# EAGLE design DMXDUNIO_n0m1 (EAGLE 5.07)
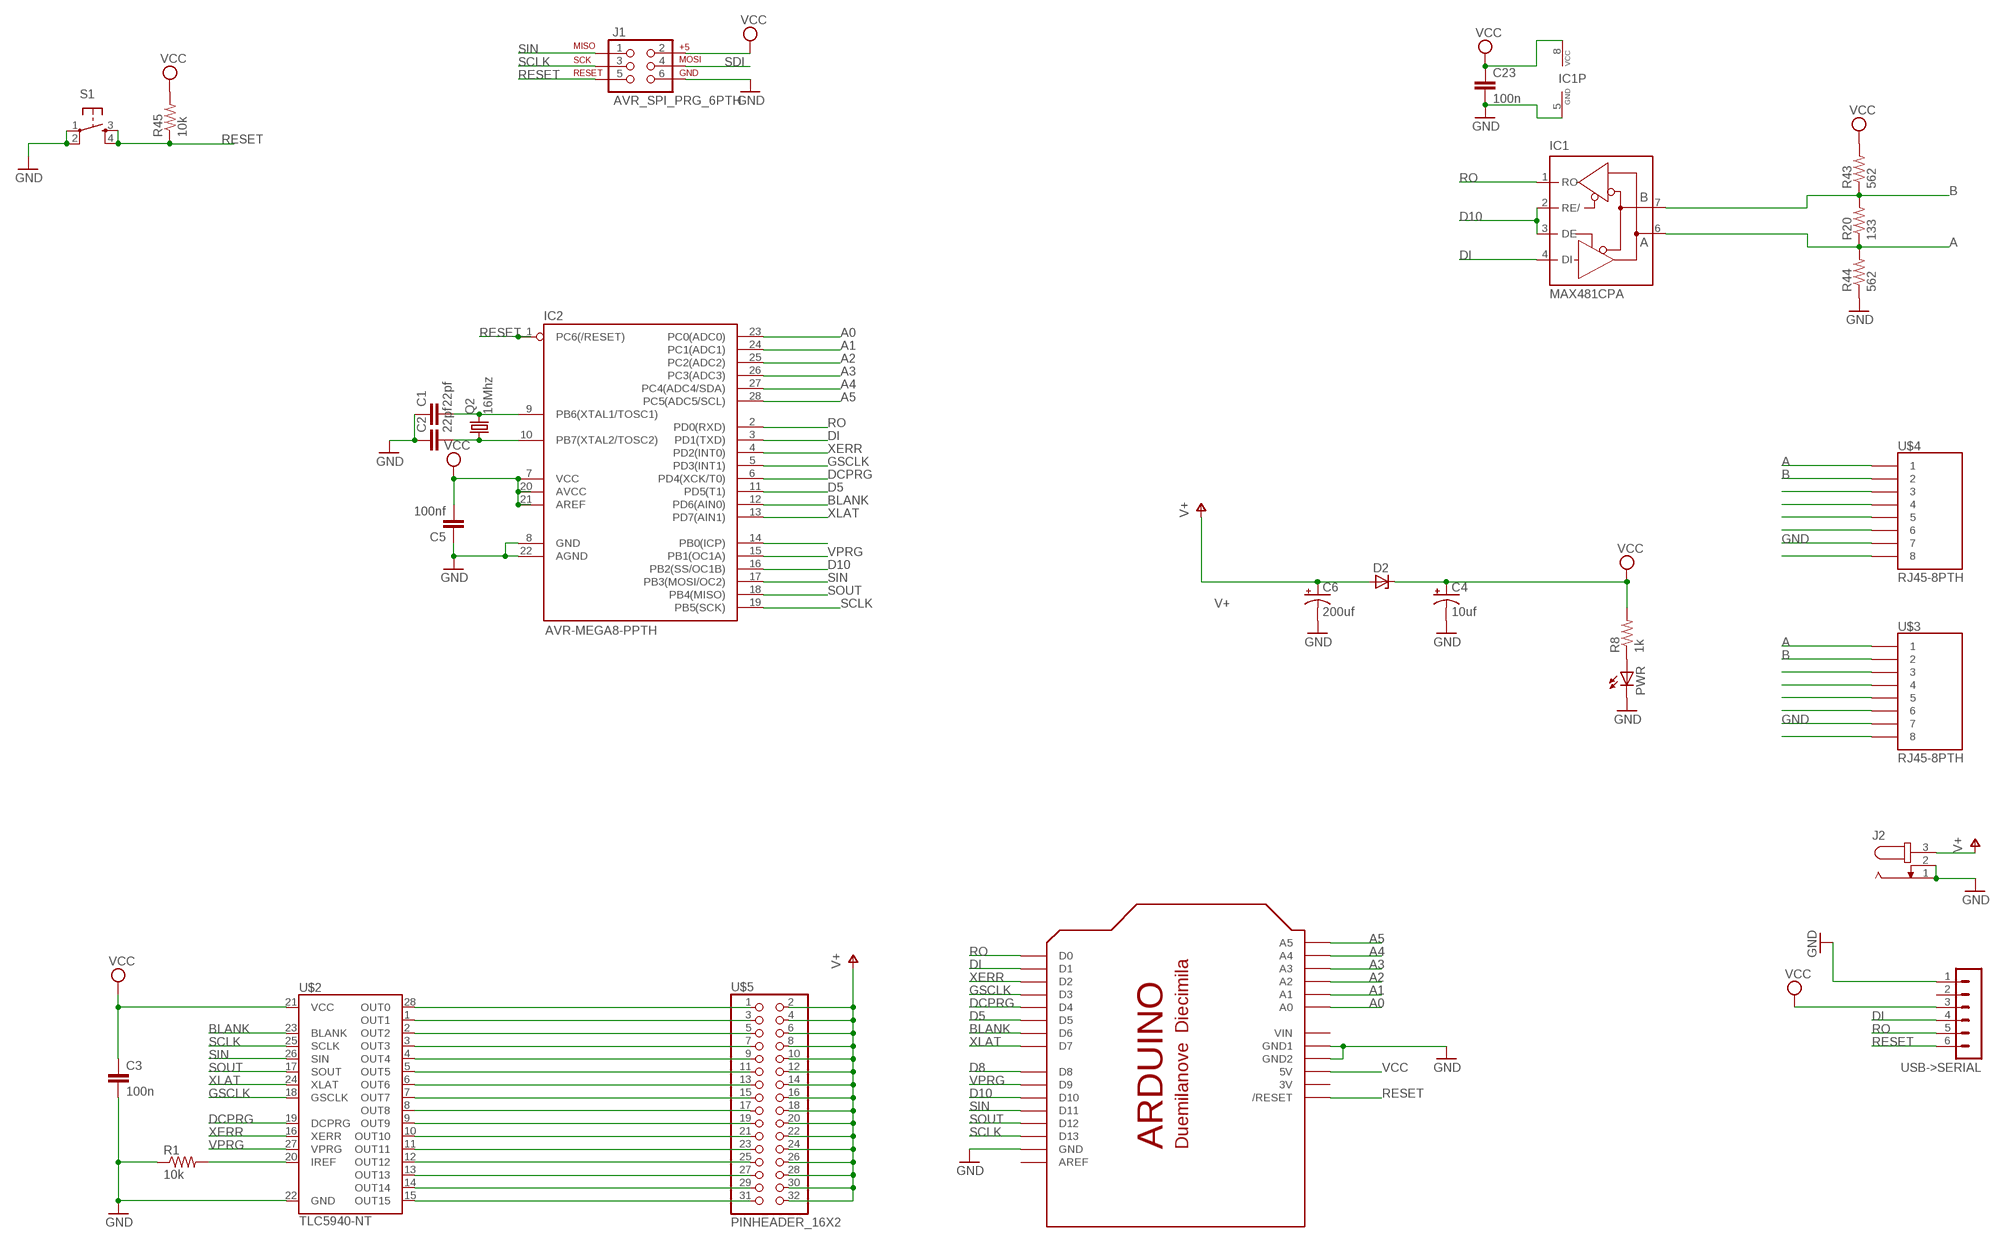
[diagram p0: schematic, sheet 1]

## Parts
C1  22pf  CAPPTH2  [CAP-PTH-SMALL2]
C2  22pf  CAPPTH2  [CAP-PTH-SMALL2]
C3  100n  CAPPTH2  [CAP-PTH-SMALL2]
C4  10uf  CPOL-USE2.5-7  [E2,5-7]
C5  100nf  CAPPTH2  [CAP-PTH-SMALL2]
C6  200uf  CPOL-USE2.5-7  [E2,5-7]
C23  100n  CAPPTH2  [CAP-PTH-SMALL2]
D2  ZENER-DIODEDO34-7  [DO34Z7]
IC1  MAX481CPA  [DIL08]
IC2  AVR-MEGA8-PPTH  [DIL28-3]
J1  AVR_SPI_PRG_6PTH  [2X3]
J2  JACK-PLUG1  [SPC4078]
PWR  LED3MM  [LED3MM]
Q2  16Mhz  CRYSTALHC49US  [HC49US]
R1  10k  RESISTORPTH-1/6W  [1/6W-RES]
R8  1k  RESISTORPTH-1/6W  [1/6W-RES]
R20  133  RESISTORPTH-1/6W  [1/6W-RES]
R43  562  RESISTORPTH-1/6W  [1/6W-RES]
R44  562  RESISTORPTH-1/6W  [1/6W-RES]
R45  10k  RESISTORPTH-1/6W  [1/6W-RES]
S1  TAC_SWITCHPTH  [TACTILE-PTH]
U$1  ARDUINO  [ARDUINO_LONG]
U$2  TLC5940-NT  [DIL28-3]
U$3  RJ45-8PTH  [RJ45-8]
U$4  RJ45-8PTH  [RJ45-8]
U$5  PINHEADER_16X2  [PINHEADER_16X2]
USB->SERIAL  MA06-1  [MA06-1]

## Nets
A: IC1.6(A) R20.1 R44.2 U$3.1 U$4.1
A0: IC2.23(PC0(ADC0)) U$1.A0
A1: IC2.24(PC1(ADC1)) U$1.A1
A2: IC2.25(PC2(ADC2)) U$1.A2
A3: IC2.26(PC3(ADC3)) U$1.A3
A4: IC2.27(PC4(ADC4/SDA)) U$1.A4
A5: IC2.28(PC5(ADC5/SCL)) U$1.A5
B: IC1.7(B) R20.2 R43.1 U$3.2 U$4.2
BLANK: IC2.12(PD6(AIN0)) U$1.D6 U$2.23(BLANK)
D5: IC2.11(PD5(T1)) U$1.D5
D8: IC2.14(PB0(ICP)) U$1.D8
D10: IC1.2(RE/) IC1.3(DE) IC2.16(PB2(SS/OC1B)) U$1.D10
DCPRG: IC2.6(PD4(XCK/T0)) U$1.D4 U$2.19(DCPRG)
DI: IC1.4(DI) IC2.3(PD1(TXD)) U$1.D1 USB->SERIAL.4
GND: C1.1 C2.1 C3.2 C4.- C5.1 C6.- C23.2 IC1.5(GND) IC2.8(GND) IC2.22(AGND) J1.6 J2.1 J2.2 PWR.K(C) R1.1 R44.1 S1.1 S1.2 U$1.GND U$1.GND1 U$1.GND2 U$2.22(GND) U$3.7 U$4.7 USB->SERIAL.1
GSCLK: IC2.5(PD3(INT1)) U$1.D3 U$2.18(GSCLK)
IREF: R1.2 U$2.20(IREF)
N$1: C1.2 IC2.9(PB6(XTAL1/TOSC1)) Q2.2
N$2: C2.2 IC2.10(PB7(XTAL2/TOSC2)) Q2.1
N$4: U$2.9(OUT9) U$5.19
N$5: U$2.10(OUT10) U$5.21
N$6: U$2.11(OUT11) U$5.23
N$8: U$2.15(OUT15) U$5.31
N$12: U$2.14(OUT14) U$5.29
N$13: U$2.13(OUT13) U$5.27
N$14: U$2.8(OUT8) U$5.17
N$15: U$2.7(OUT7) U$5.15
N$16: U$2.5(OUT5) U$5.11
N$17: U$2.4(OUT4) U$5.9
N$18: U$2.2(OUT2) U$5.5
N$19: PWR.A R8.1
N$20: U$2.1(OUT1) U$5.3
N$23: U$4.3
N$24: U$4.4
N$25: U$4.5
N$26: U$4.6
N$28: U$4.8
N$31: U$3.3
N$32: U$3.4
N$33: U$3.5
N$34: U$3.6
N$36: U$3.8
RESET: IC2.1(PC6(/RESET)) J1.5 R45.1 S1.3 S1.4 U$1.RESET(/RESET) USB->SERIAL.6
RO: IC1.1(RO) IC2.2(PD0(RXD)) U$1.D0 USB->SERIAL.5
SCLK: IC2.19(PB5(SCK)) J1.3 U$1.D13 U$2.25(SCLK)
SDI: J1.4
SIN: IC2.17(PB3(MOSI/OC2)) J1.1 U$1.D11 U$2.26(SIN)
SOUT: IC2.18(PB4(MISO)) U$1.D12 U$2.17(SOUT)
V+: C6.+ D2.A J2.3 U$5.2 U$5.4 U$5.6 U$5.8 U$5.10 U$5.12 U$5.14 U$5.16 U$5.18 U$5.20 U$5.22 U$5.24 U$5.26 U$5.28 U$5.30 U$5.32
VCC: C3.1 C4.+ C5.2 C23.1 D2.C IC1.8(VCC) IC2.7(VCC) IC2.20(AVCC) IC2.21(AREF) J1.2 R8.2 R43.2 R45.2 U$1.5V U$2.21(VCC) USB->SERIAL.3
VPRG: IC2.15(PB1(OC1A)) U$1.D9 U$2.27(VPRG)
X1: U$2.28(OUT0) U$5.1
X2: U$2.3(OUT3) U$5.7
X3: U$2.6(OUT6) U$5.13
X4: U$2.12(OUT12) U$5.25
XERR: IC2.4(PD2(INT0)) U$1.D2 U$2.16(XERR)
XLAT: IC2.13(PD7(AIN1)) U$1.D7 U$2.24(XLAT)
Unconnected: U$1.AREF USB->SERIAL.2

## Power pins joined to a net without a drawn wire
3V: U$1.3V
VIN: U$1.VIN

## Library data of the parts
C1-C3 C5 C23 = SparkFun:CAP: Capacitor Standard 0603 ceramic capacitor, and 0.1" leaded capacitor.
C4 C6 = resistor:CPOL-US: POLARIZED CAPACITOR, American symbol
D2 = diode:ZENER-DIODE: Z-Diode
IC1 = maxim:MAX481CPA: RS485 TRANSEIVER
IC2 = SparkFun:AVR-MEGA8-P: MICROCONTROLLER 8 Kbytes FLASH 1 kbytes SRAM 512 bytes EEPROM USART 4-channel 10 bit ADC 2-channel 8 bit ADC
J1 = SparkFun:AVR_SPI_PRG_6: AVR ISP 6 Pin This is the reduced ISP connector for AVR programming. Common on Arduino. This footprint will take up less PCB space and can be used with a 10-pin to 6-pin adapter such as SKU: BOB-08508
J2 = con-jack:JACK-PLUG: DC POWER JACK Power Jack, DC, Right Angle, Through Hole, Rated 5A at 16VDC, PC Terminals Distributor: Farnell (www.Farnell.de) Drawing: 84N1161.pdf / 84N1162.pdf Manufacturer: SPC Technology (www.spctechnology.com) Type: SPC4077 / SPC 4078
PWR = SparkFun:LED: LEDs Standard schematic elements and footprints for 5mm, 3mm, 1206, and 0603 sized LEDs. 5mm - Spark Fun Electronics SKU : COM-00529 (and others)
Q2 = SparkFun:CRYSTAL: Crystals Various standard crystals. Proven footprints. Spark Fun Electronics SKU : COM-00534
R1 R8 R20 R43-R45 = SparkFun:RESISTOR: Resistor Basic schematic elements and footprints for 0603, 1206, and PTH resistors.
S1 = SparkFun:TAC_SWITCH: Momentary Switch Button commonly used for reset or general input. Spark Fun Electronics SKU : COM-00097
U$1 = LEDControl:ARDUINO
U$2 = SparkFun:TLC5940: TI TLC5940 16-channel LED Driver with Dot Correction and Grayscale PWM Control The TLC5940 is a 16-channel, constant-current sink LED driver. Each channel has an individually adjustable 4096-step grayscale PWM brightness control and a 64-step, constant-current sink (dot correction). The dot correction adjusts the brightness variations between LED channels and other LED drivers. The dot correction data is stored in an integrated EEPROM. Both grayscale control and dot correction are accessible via a serial interface. A single external resistor sets the maximum current value of all 16 channels. Packages: 28-pin HTSSOP 32-pin 5x5mm QFN 28-pin DIP
U$3 U$4 = SparkFun:RJ45-8: RJ45 Jack Simple RJ45, 8-pin connection - connector for common Cat5, Cat5e, and Cat6 Ethernet cables. Footprint not yet proven in production. Connector sku is PRT-00643; Breakout PCB sku is BOB-00716.
U$5 = LEDControl:PINHEADER_16X2
USB->SERIAL = con-lstb:MA06-1: PIN HEADER

## Board
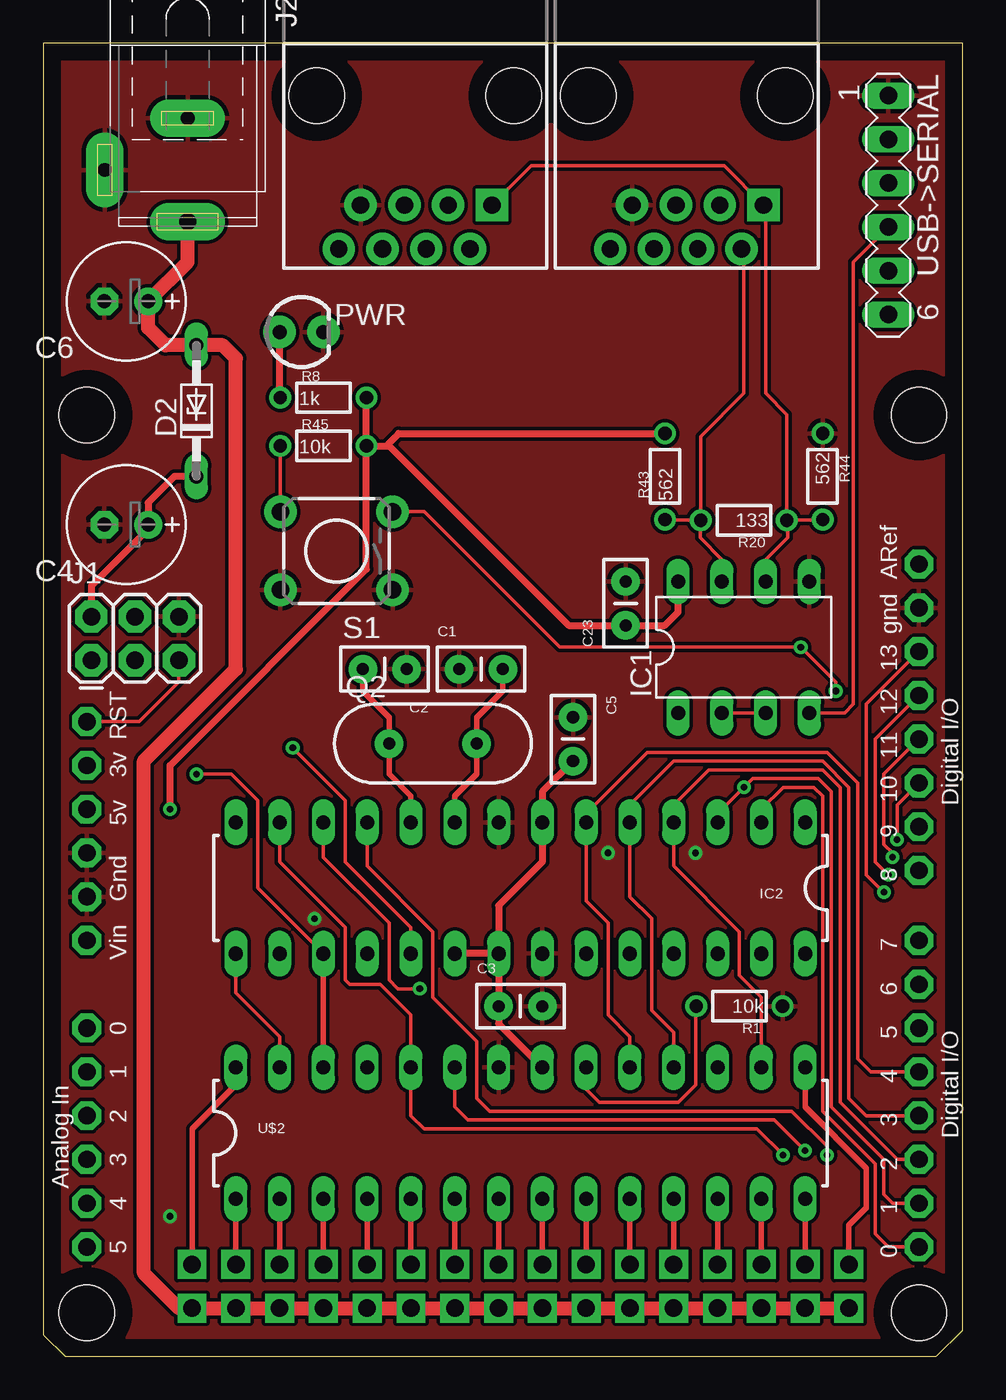
[diagram p1: board, top side]
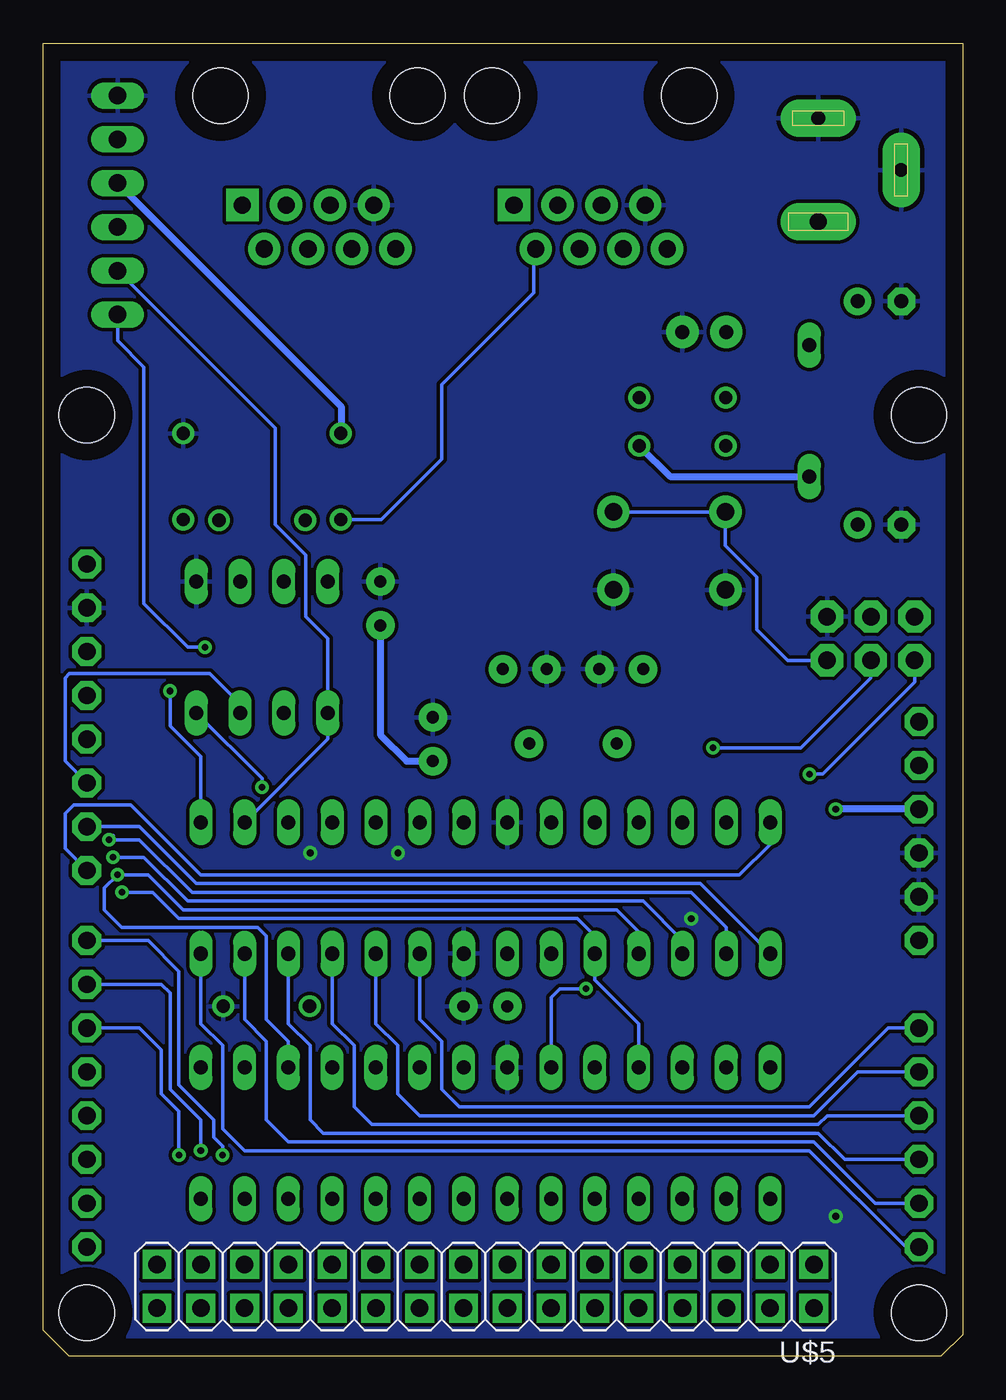
[diagram p2: board, bottom side, seen from below]

Size 53.34 x 76.2 mm. Coordinates in mm from the lower left corner, seen from the top.
Copper layers (1*16): Top 0.035mm / dielectric 1.5mm / Bottom 0.035mm
Design rules "default": minimum track width 10mil, minimum drill 24mil, track to track 8mil, track to pad 8mil, pad to pad 8mil, via to via 8mil, smd to smd 8mil, copper to edge 40mil, drill to drill 8mil, minimum pad ring 10mil, minimum via ring 8mil, stop-mask expansion 4mil, vias tented up to drill 0mil, thermal gap 10mil

### Footprints (pad centres in the part's own frame; a part is rotated, then mirrored left to right if it is on the bottom)
CAP-PTH-SMALL2 = drill 0.7 pad 1.651 round: 1 0,0; 2 2.54,0
E2,5-7 = drill 0.813 pad 1.6 round: + -1.27,0 | drill 0.813 pad 1.6 octagon: - 1.27,0
DO34Z7 = drill 0.813 long: A 3.81,0; C -3.81,0
DIL08 = drill 0.813 long: 1 -3.81,-3.81; 2 -1.27,-3.81; 3 1.27,-3.81; 4 3.81,-3.81; 5 3.81,3.81; 6 1.27,3.81; 7 -1.27,3.81; 8 -3.81,3.81
DIL28-3 = drill 0.813 long: 1 -16.51,-3.81; 2 -13.97,-3.81; 3 -11.43,-3.81; 4 -8.89,-3.81; 5 -6.35,-3.81; 6 -3.81,-3.81; 7 -1.27,-3.81; 8 1.27,-3.81; 9 3.81,-3.81; 10 6.35,-3.81; 11 8.89,-3.81; 12 11.43,-3.81; 13 13.97,-3.81; 14 16.51,-3.81; 15 16.51,3.81; 16 13.97,3.81; 17 11.43,3.81; 18 8.89,3.81; 19 6.35,3.81; 20 3.81,3.81; 21 1.27,3.81; 22 -1.27,3.81; 23 -3.81,3.81; 24 -6.35,3.81; 25 -8.89,3.81; 26 -11.43,3.81; 27 -13.97,3.81; 28 -16.51,3.81
2X3 = drill 1.016 pad 1.88 octagon: 1 0,0; 2 0,2.54; 3 2.54,0; 4 2.54,2.54; 5 5.08,0; 6 5.08,2.54
SPC4078 = drill 0.8 pad 2.184 long: 1 -3,0; 2 0,-4.8 | drill 1 pad 2.184 long: 3 3,0
LED3MM = drill 0.813 pad 1.88 round: A -1.27,0; K 1.27,0
HC49US = drill 0.7 pad 1.651 round: 1 -2.54,0; 2 2.54,0
1/6W-RES = drill 0.762 round: 1 -2.5,0; 2 2.5,0
TACTILE-PTH = drill 1.016 pad 1.88 round: 1 -3.251,2.261; 2 3.251,2.261; 3 -3.251,-2.261; 4 3.251,-2.261
ARDUINO_LONG = drill 1 pad 1.676 octagon: 3V 1.27,-24.13; 5V 3.81,-24.13; A0 16.51,-24.13; A1 19.05,-24.13; A2 21.59,-24.13; A3 24.13,-24.13; A4 26.67,-24.13; A5 29.21,-24.13; AREF -10.414,24.13; D0 29.21,24.13; D1 26.67,24.13; D2 24.13,24.13; D3 21.59,24.13; D4 19.05,24.13; D5 16.51,24.13; D6 13.97,24.13; D7 11.43,24.13; D8 7.366,24.13; D9 4.826,24.13; D10 2.286,24.13; D11 -0.254,24.13; D12 -2.794,24.13; D13 -5.334,24.13; GND -7.874,24.13; GND1 8.89,-24.13; GND2 6.35,-24.13; RESET -1.27,-24.13; VIN 11.43,-24.13 | hole 3.2: -19.05,24.13; 33.02,24.13; -19.05,-24.13; 33.02,-24.13
RJ45-8 = drill 1 pad 1.88 square: 1 -4.445,6.35 | drill 1 pad 1.88 round: 2 -3.175,8.89; 3 -1.905,6.35; 4 -0.635,8.89; 5 0.635,6.35; 6 1.905,8.89; 7 3.175,6.35; 8 4.445,8.89 | hole 3.2: -5.715,0; 5.715,0
PINHEADER_16X2 = drill 1.016 pad 1.676 square: 1 -19.05,-1.27; 2 -19.05,1.27; 3 -16.51,-1.27; 4 -16.51,1.27; 5 -13.97,-1.27; 6 -13.97,1.27; 7 -11.43,-1.27; 8 -11.43,1.27; 9 -8.89,-1.27; 10 -8.89,1.27; 11 -6.35,-1.27; 12 -6.35,1.27; 13 -3.81,-1.27; 14 -3.81,1.27; 15 -1.27,-1.27; 16 -1.27,1.27; 17 1.27,-1.27; 18 1.27,1.27; 19 3.81,-1.27; 20 3.81,1.27; 21 6.35,-1.27; 22 6.35,1.27; 23 8.89,-1.27; 24 8.89,1.27; 25 11.43,-1.27; 26 11.43,1.27; 27 13.97,-1.27; 28 13.97,1.27; 29 16.51,-1.27; 30 16.51,1.27; 31 19.05,-1.27; 32 19.05,1.27
MA06-1 = drill 1.016 long: 1 -6.35,0; 2 -3.81,0; 3 -1.27,0; 4 1.27,0; 5 3.81,0; 6 6.35,0

### Placement (x,y rotation side)
C1  24.13,39.88 0 top
C2  21.08,39.88 180 top
C3  26.42,20.32 0 top
C4  4.83,48.26 180 top
C5  30.73,37.08 270 top
C6  4.83,61.21 180 top
C23  33.78,42.42 90 top
D2  8.89,54.86 90 top
IC1  40.64,41.15 0 top
IC2  27.69,27.18 180 top
J1  2.79,40.39 0 top
J2  8.38,68.83 270 top
PWR  14.99,59.44 0 top
Q2  22.61,35.56 0 top
R1  40.39,20.32 180 top
R8  16.26,55.63 0 top
R20  40.64,48.51 180 top
R43  36.07,51.05 90 top
R44  45.21,51.05 270 top
R45  16.26,52.83 0 top
S1  17.02,46.74 180 top
U$1  26.67,35.56 270 top
U$2  27.69,12.95 0 top
U$3  37.34,73.15 180 top
U$4  21.59,73.15 180 top
U$5  27.69,4.06 180 bottom
USB->SERIAL  49.02,66.8 270 top

### Tracks (layer width: path | path; a pad name or v marks a point on that pad's centre or on a via)
A
  Top 0.203: IC1.6 41.91,46.23 43.18,47.5 43.18,48.47 R20.1 | R20.1 45.17,48.51 R44.2 | R20.1 43.14,54.65 41.91,55.88 41.91,66.68 U$3.1 39.5,69.09 28.32,69.09 U$4.1
A0
  Bottom 0.203: IC2.23 31.5,19.56 30.23,18.29 30.23,15.49 29.21,14.48 8.89,14.48 4.32,19.05 U$1.A0
A1
  Bottom 0.203: IC2.24 34.04,19.3 32.77,18.03 32.77,15.24 31.5,13.97 8.64,13.97 6.1,16.51 U$1.A1
A2
  Bottom 0.203: IC2.25 36.58,19.3 35.31,18.03 35.31,14.48 34.29,13.46 8.38,13.46 7.87,13.97 U$1.A2
A3
  Bottom 0.203: IC2.26 39.12,19.3 37.85,18.03 37.85,13.72 37.08,12.95 8.38,12.95 6.86,11.43 U$1.A3
A4
  Bottom 0.203: IC2.27 41.66,19.56 40.39,18.29 40.39,13.72 39.12,12.45 8.64,12.45 5.08,8.89 U$1.A4
A5
  Bottom 0.203: IC2.28 44.2,19.3 42.93,18.03 42.93,13.21 41.66,11.94 8.89,11.94 3.3,6.35 U$1.A5
B
  Top 0.203: IC1.7 39.37,46.23 38.1,47.5 38.1,48.47 R20.2 | R20.2 36.11,48.51 R43.1 | R20.2 38.14,53.38 40.64,55.88 40.64,64.14 U$3.2
  Bottom 0.203: R43.1 33.74,48.55 30.23,52.07 30.23,56.39 24.89,61.72 24.89,64.14 U$4.2
BLANK  (via drill 0.38)
  Top 0.203: IC2.12 16.26,28.96 20.07,25.15 20.07,21.84 20.57,21.34 v21.84,21.34 | U$2.23 23.88,14.48 24.64,13.72 42.42,13.72 v44.2,11.94
  Bottom 0.203: v21.84,21.34 23.37,21.34 23.88,20.83 U$2.23 | U$1.D6 46.48,21.59 45.97,21.08 45.97,15.49 44.2,13.72 v44.2,11.94
D5  (via drill 0.38)
  Top 0.203: IC2.11 18.8,28.45 22.61,24.64 22.61,20.83 25.15,18.29 25.15,14.99 25.91,14.22 43.43,14.22 45.47,12.19 v45.47,11.68
  Bottom 0.203: v45.47,11.68 45.47,14.22 46.48,15.24 46.48,17.78 47.75,19.05 U$1.D5
D8
  Bottom 0.203: IC2.14 11.18,29.72 12.95,27.94 44.2,27.94 48.26,32 51.56,32 52.07,31.5 52.07,29.46 U$1.D8
D10  (via drill 0.38)
  Top 0.203: U$1.D10 49.53,32 v49.53,29.97 | IC1.3 IC1.2
  Bottom 0.203: IC2.16 13.72,24.89 15.75,26.92 44.7,26.92 47.75,29.97 v49.53,29.97 49.28,30.23 | IC1.3 41.91,37.85 43.69,39.62 51.82,39.62 52.07,39.37 52.07,34.54 U$1.D10
DCPRG
  Top 0.203: U$1.D4 48.01,16.51 47.24,17.27 47.24,33.27 45.47,35.05 35.05,35.05 31.5,31.5 IC2.6 31.5,26.42 32.77,25.15 32.77,19.81 34.04,18.54 U$2.19
DI  (via drill 0.38)
  Top 0.203: IC2.3 39.12,31.5 v40.64,33.02 41.15,33.53 44.96,33.53 45.72,32.77 45.72,14.48 48.77,11.43 48.77,9.4 49.28,8.89 U$1.D1 | IC1.4 46.48,37.34 46.99,37.85 46.99,63.5 USB->SERIAL.4
  Bottom 0.203: IC1.4 40.64,33.53 v40.64,33.02
GND  (via drill 0.38)
  other vias: 32.77,29.21 37.85,29.21 15.75,25.4 7.37,8.13
  pour Top: -8.38,84.33 66.29,84.33 66.29,-10.41 -8.38,-10.41
  pour Bottom: -14.22,82.04 67.06,82.04 67.06,-11.18 -14.22,-11.18
GSCLK
  Top 0.203: U$1.D3 47.75,13.97 46.74,14.99 46.74,33.02 45.21,34.54 36.58,34.54 34.04,32 IC2.5 34.04,26.67 35.31,25.4 35.31,20.07 36.58,18.8 U$2.18
IREF
  Top 0.203: U$2.20 31.5,15.49 32.26,14.73 36.83,14.73 37.85,15.75 37.85,20.28 R1.2
N$1
  Top 0.305: IC2.9 23.88,32.51 25.15,33.78 Q2.2 25.15,37.08 26.67,38.61 C1.2
N$2
  Top 0.305: IC2.10 21.34,32.51 20.07,33.78 Q2.1 20.07,37.08 18.54,38.61 C2.2
N$3  (via drill 0.38)
  other vias: 49.28,28.96
N$4
  Top 0.305: U$5.19 U$2.9
N$5
  Top 0.305: U$5.21 U$2.10
N$6
  Top 0.305: U$5.23 U$2.11
N$7  (via drill 0.38)
  other vias: 49.02,27.94
N$8
  Top 0.305: U$2.15 44.2,14.48 47.75,10.92 47.75,8.64 46.74,7.62 U$5.31
N$9  (via drill 0.38)
  other vias: 48.77,26.92
N$12
  Top 0.305: U$5.29 U$2.14
N$13
  Top 0.305: U$5.27 U$2.13
N$14
  Top 0.305: U$5.17 U$2.8
N$15
  Top 0.305: U$5.15 U$2.7
N$16
  Top 0.305: U$5.11 U$2.5
N$17
  Top 0.305: U$5.9 U$2.4
N$18
  Top 0.305: U$5.5 U$2.2
N$19
  Top 0.406: R8.1 13.72,55.67 PWR.A
N$20
  Top 0.305: U$5.3 U$2.1
RESET  (via drill 0.38)
  Top 0.203: v45.97,38.61 45.97,39.12 v43.94,41.15 29.97,41.15 22.1,49.02 20.3,49.02 S1.3 | S1.4 R45.1 | J1.5 7.87,39.12 5.59,36.83 U$1.RESET
  Bottom 0.203: IC2.1 44.2,34.8 45.97,36.58 v45.97,38.61 | J1.5 10.16,40.39 11.94,42.16 11.94,45.21 13.77,47.04 S1.4 S1.3 | v43.94,41.15 44.96,41.15 47.5,43.69 47.5,57.4 49.02,58.93 USB->SERIAL.6
RO
  Top 0.203: IC2.2 41.66,31.75 42.93,33.02 44.7,33.02 45.21,32.51 45.21,14.22 48.26,11.18 48.26,7.11 49.02,6.35 U$1.D0
  Bottom 0.203: IC2.2 36.83,35.81 IC1.1 36.83,41.66 38.1,42.93 38.1,46.48 39.88,48.26 39.88,53.85 USB->SERIAL.5
SCLK  (via drill 0.38)
  Top 0.203: v48.77,26.92 47.75,27.94 47.75,37.85 U$1.D13 | IC2.19 21.34,24.89 17.53,28.7 17.53,32.26 v14.48,35.31
  Bottom 0.203: v48.77,26.92 46.99,26.92 45.47,25.4 22.35,25.4 21.34,24.38 IC2.19 21.34,21.84 18.8,19.3 U$2.25 | J1.3 5.33,39.37 9.4,35.31 v14.48,35.31
SIN  (via drill 0.38)
  Top 0.203: v49.28,28.96 49.28,29.21 48.77,29.72 48.77,33.78 U$1.D11 | IC2.17 12.45,27.18 12.45,32.26 10.92,33.78 v8.89,33.78
  Top 0.305: U$2.26 IC2.17
  Bottom 0.203: IC2.17 16.26,24.13 18.54,26.42 44.96,26.42 47.5,28.96 v49.28,28.96 | v8.89,33.78 8.13,33.78 2.79,39.12 J1.1
SOUT  (via drill 0.38)
  Top 0.203: v49.02,27.94 48.26,28.7 48.26,35.81 U$1.D12
  Bottom 0.203: IC2.18 18.8,24.64 20.07,25.91 45.21,25.91 47.24,27.94 v49.02,27.94 49.78,27.18 49.78,25.91 48.77,24.89 40.89,24.89 40.39,24.38 40.39,19.56 39.12,18.29 U$2.17
V+
  Top 0.813: U$5.32 U$5.30 U$5.28 U$5.26 U$5.24 U$5.22 U$5.20 U$5.18 U$5.16 U$5.14 U$5.12 U$5.10 U$5.8 U$5.6 U$5.4 U$5.2 7.87,2.79 5.84,4.83 5.84,34.54 11.18,39.88 11.18,57.91 10.41,58.67 D2.A 7.11,58.67 6.1,59.69 C6.+ 8.38,63.5 J2.3
VCC  (via drill 0.38)
  Top 0.406: IC2.21 IC2.20 | IC2.21 26.42,26.16 28.96,28.7 IC2.7 28.96,32.77 C5.2 | IC2.21 C3.1 26.42,19.3 U$2.21 | D2.C 7.62,51.05 6.1,49.53 C4.+ 6.1,48.01 2.79,44.7 J1.2 | 19.89,52.83 20.07,52.83 30.48,42.42 C23.1 36.07,42.42 36.83,43.18 IC1.8 | R45.2 R8.2 | R43.2 20.61,53.55 19.89,52.83 | R45.2 19.89,52.83 | R45.2 18.76,45.68 7.37,34.29 v7.37,31.75
  Bottom 0.406: C5.2 32.26,34.54 33.78,36.07 C23.1 | D2.C 16.98,51.05 R45.2 | USB->SERIAL.3 36.03,55.08 36.03,53.59 R43.2 | U$1.5V v7.37,31.75
VPRG
  Top 0.203: 11.18,22.1 11.18,21.08 13.72,18.54 U$2.27
  Top 0.305: 11.18,22.1 IC2.15
  Bottom 0.203: IC2.15 15.24,27.43 44.45,27.43 47.75,30.73 U$1.D9
X1
  Top 0.305: U$2.28 11.18,15.75 8.64,13.21 U$5.1
X2
  Top 0.305: U$5.7 U$2.3
X3
  Top 0.305: U$5.13 U$2.6
X4
  Top 0.305: U$5.25 U$2.12
XERR
  Top 0.203: U$1.D2 49.53,11.43 46.23,14.73 46.23,33.02 45.21,34.04 38.61,34.04 36.58,32 IC2.4 36.58,28.45 40.39,24.64 40.39,22.1 41.66,20.83 U$2.16
XLAT  (via drill 0.38)
  Top 0.203: IC2.13 13.72,28.7 17.53,24.89 17.53,21.84 17.78,21.59 19.56,21.59 21.34,19.81 U$2.24 21.34,13.97 22.1,13.21 41.4,13.21 v42.93,11.68
  Bottom 0.203: U$1.D7 47.24,24.13 45.47,22.35 45.47,15.75 43.43,13.72 43.43,12.7 42.93,12.19 v42.93,11.68